# EAGLE design Mega_Shield_enjaksa (EAGLE 9.5.1)
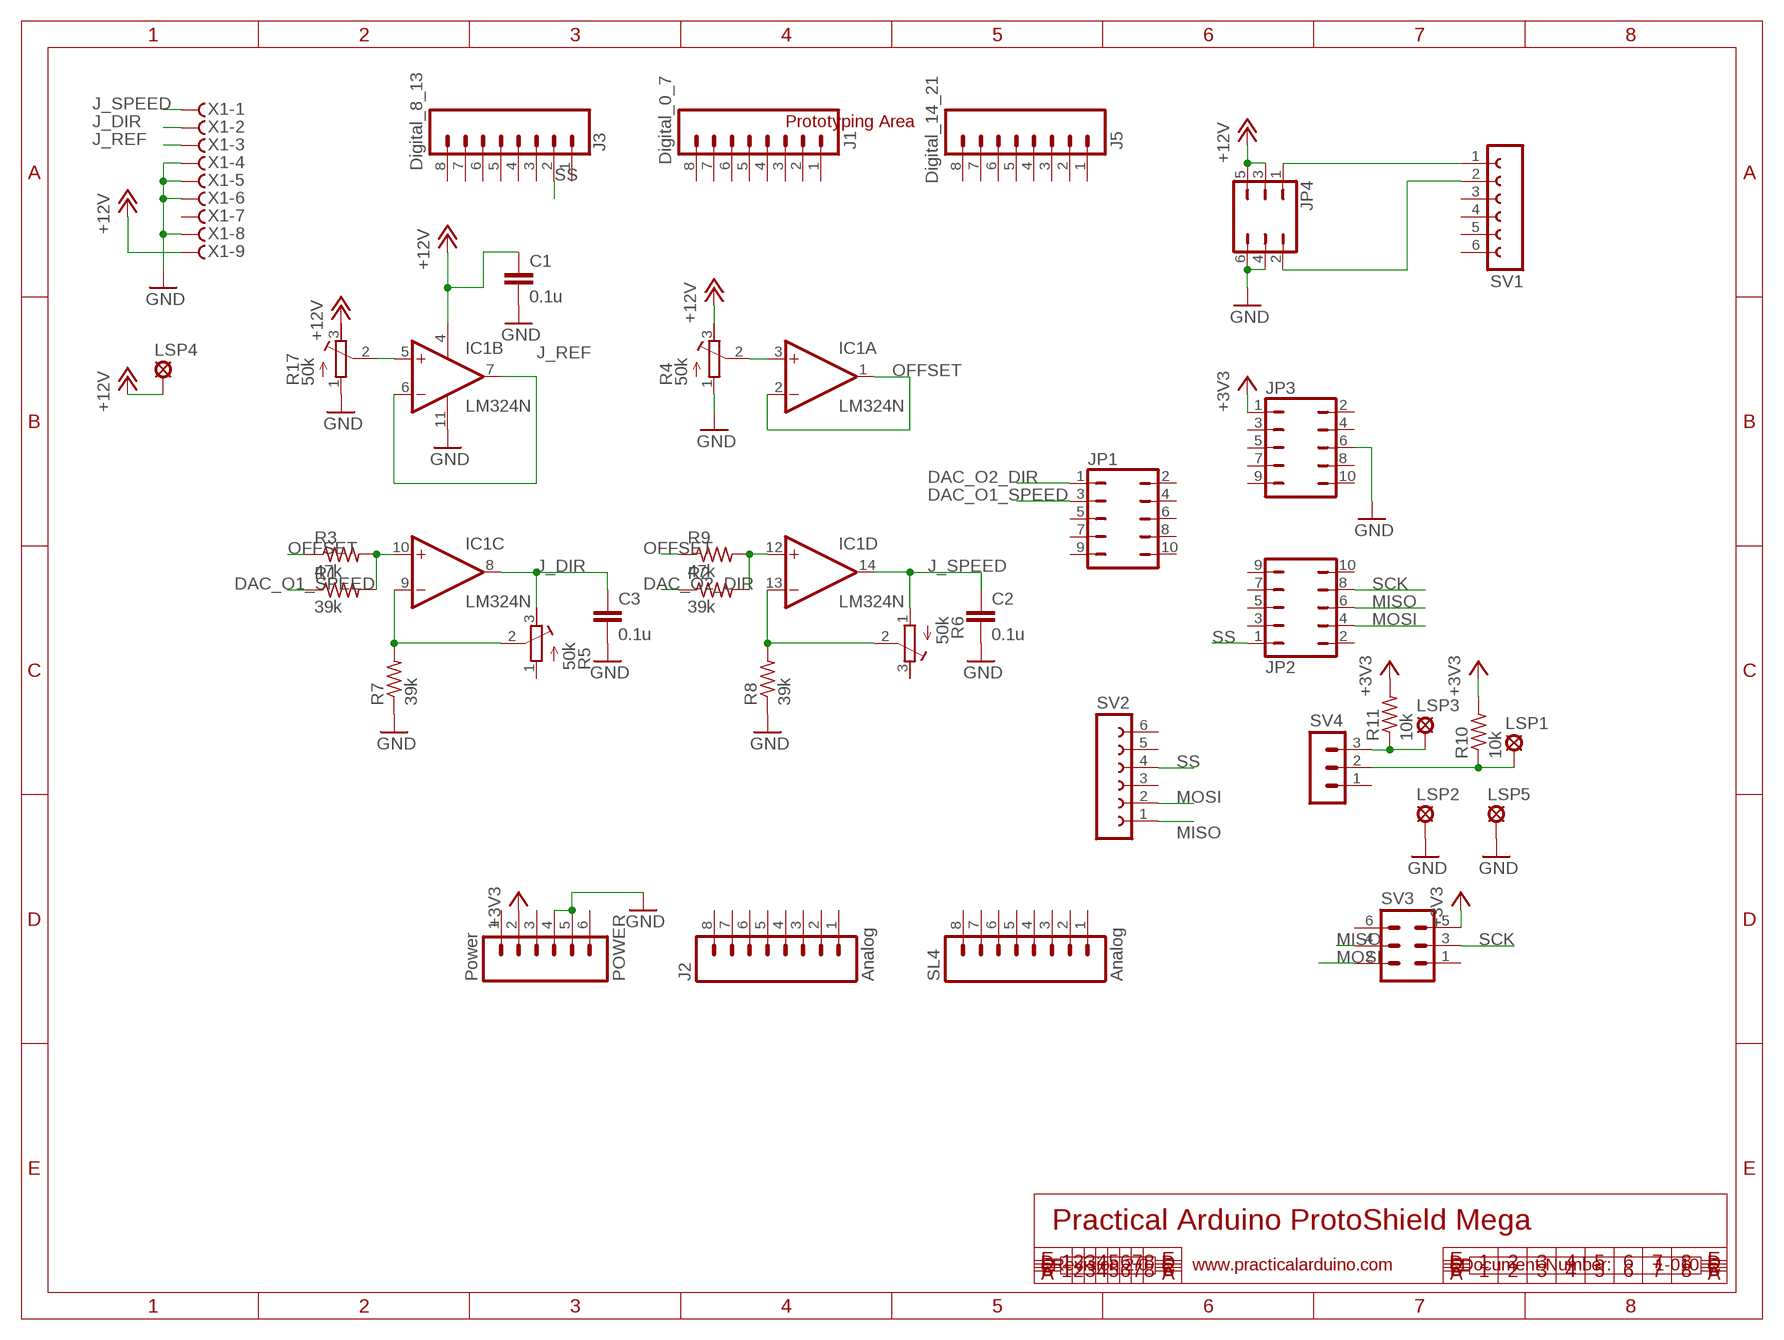
[diagram p0: schematic, sheet 1]

## Parts
C1  0.1u  C-EU025-024X044  [C025-024X044]
C2  0.1u  C-EU050-025X075  [C050-025X075]
C3  0.1u  C-EU025-024X044  [C025-024X044]
IC1  LM324N  [DIL14]
J1  Digital_0_7  M08  [1X08]
J2  Analog  M08  [1X08]
J3  Digital_8_13  M08  [1X08]
J5  Digital_14_21  M08  [1X08]
JP1  JP5Q  [JP5Q]
JP2  JP5Q  [JP5Q]
JP3  JP5Q  [JP5Q]
JP4  JP3Q  [JP3Q]
LSP1  SE13  [SE13]
LSP2  SE13  [SE13]
LSP3  SE13  [SE13]
LSP4  SE13  [SE13]
LSP5  SE13  [SE13]
POWER  Power  M06SIP  [1X06]
R1  39k  R-US_0204/7  [0204/7]
R2  39k  R-US_0204/7  [0204/7]
R3  47k  R-US_0204/7  [0204/7]
R4  50k  R-TRIMM64W  [RTRIM64W]
R5  50k  R-TRIMM64W  [RTRIM64W]
R6  50k  R-TRIMM64W  [RTRIM64W]
R7  39k  R-US_0204/7  [0204/7]
R8  39k  R-US_0204/2V  [0204V]
R9  47k  R-US_0204/7  [0204/7]
R10  10k  R-US_0204/2V  [0204V]
R11  10k  R-US_0204/2V  [0204V]
R17  50k  R-TRIMM64W  [RTRIM64W]
SL4  Analog  M08  [1X08]
SV1  FE06-1  [FE06]
SV2  FE06-1  [FE06]
SV3  MA03-2  [MA03-2]
SV4  MA03-1  [MA03-1]
X1  F09HS  [F09H]

## Nets
+3V3: JP3.1 POWER.2 R10.2 R11.2 SV3.5
+12V: C1.1 IC1.4(P:V+) JP4.3 JP4.5 LSP4.MP R4.3(E) R17.3(E) X1.9
DAC_O1_SPEED: JP1.3 R1.1
DAC_O2_DIR: JP1.1 R2.1
GND: C1.2 C2.2 C3.2 IC1.11(P:V-) JP3.6 JP4.4 JP4.6 LSP2.MP LSP5.MP POWER.4 POWER.5 R4.1(A) R7.1 R8.1 R17.1(A) X1.4 X1.5 X1.6 X1.8
J_DIR: C3.1 IC1.8(C:OUT) R5.3(E) X1.2
J_REF: IC1.6(B:-IN) IC1.7(B:OUT) X1.3
J_SPEED: C2.1 IC1.14(D:OUT) R6.1(A) X1.1
MISO: JP2.6 SV2.1 SV3.4
MOSI: JP2.4 SV2.2 SV3.2
N$1: JP4.2 SV1.2
N$2: IC1.5(B:+IN) R17.2(S)
N$3: IC1.3(A:+IN) R4.2(S)
N$4: JP4.1 SV1.1
N$5: LSP3.MP R11.1 SV4.3
N$6: LSP1.MP R10.1 SV4.2
N$363: IC1.13(D:-IN) R6.2(S) R8.2
N$365: IC1.12(D:+IN) R2.2 R9.2
N$366: IC1.9(C:-IN) R5.2(S) R7.2
N$368: IC1.10(C:+IN) R1.2 R3.2
OFFSET: IC1.1(A:OUT) IC1.2(A:-IN) R3.1 R9.1
SCK: JP2.8 SV3.3
SS: J3.2 JP2.1 SV2.4
Unconnected: J1.1 J1.2 J1.3 J1.4 J1.5 J1.6 J1.7 J1.8 J2.1 J2.2 J2.3 J2.4 J2.5 J2.6 J2.7 J2.8 J3.1 J3.3 J3.4 J3.5 J3.6 J3.7 J3.8 J5.1 J5.2 J5.3 J5.4 J5.5 J5.6 J5.7 J5.8 JP1.2 JP1.4 JP1.5 JP1.6 JP1.7 JP1.8 JP1.9 JP1.10 JP2.2 JP2.3 JP2.5 JP2.7 JP2.9 JP2.10 JP3.2 JP3.3 JP3.4 JP3.5 JP3.7 JP3.8 JP3.9 JP3.10 POWER.1 POWER.3 POWER.6 R5.1(A) R6.3(E) SL4.1 SL4.2 SL4.3 SL4.4 SL4.5 SL4.6 SL4.7 SL4.8 SV1.3 SV1.4 SV1.5 SV1.6 SV2.3 SV2.5 SV2.6 SV3.1 SV3.6 SV4.1 X1.7

## Notes on the sheet
- Prototyping Area
- Practical Arduino ProtoShield Mega
- Revision 2.0 | www.practicalarduino.com | Document Number: | 1-010

## Library data of the parts
C1-C3 = rcl:C-EU: CAPACITOR, European symbol; SPICEPREFIX: C
IC1 = linear:LM324: OP AMP
J1-J3 J5 SL4 = SparkFun:M08: Header 8 Standard 8-pin 0.1" header. Use with straight break away headers (SKU : PRT-00116), right angle break away headers (PRT-00553), swiss pins (PRT-00743), machine pins (PRT-00117), and female headers (PRT-00115).
JP1-JP3 = jumper:JP5Q: JUMPER
JP4 = jumper:JP3Q: JUMPER
LSP1-LSP5 = solpad:SE13: SOLDER PAD E1542, drill 1,3mm, distributor Buerklin, 07F815
POWER = SparkFun:M06: Header 6 Standard 6-pin 0.1" header. Use with straight break away headers (SKU : PRT-00116), right angle break away headers (PRT-00553), swiss pins (PRT-00743), machine pins (PRT-00117), and female headers (PRT-00115). Molex polarized connector foot print use with SKU : PRT-08094 with associated crimp pins and housings. NOTES ON THE VARIANTS LOCK and LOCK_LONGPADS... This footprint was designed to help hold the alignment of a through-hole component (i.e. 6-pin header) while soldering it into place. You may notice that each hole has been shifted either up or down by 0.005 of an inch from it's more standard position (which is a perfectly straight line). This slight alteration caused the pins (the squares in the middle) to touch the edges of the holes. Because they are alternating, it causes a "brace" to hold the component in place. 0.005 has proven to be the perfect amount of "off-center" position when using our standard breakaway headers. Although looks a little odd when you look at the bare footprint, once you have a header in there, the alteration is very hard to notice. Also, if you push a header all the way into place, it is covered up entirely on the bottom side. This idea of altering the position of holes to aid alignment will be further integrated into the Sparkfun Library for other footprints. It can help hold any component with 3 or more connection pins.
R1-R3 R7-R11 = rcl:R-US_: RESISTOR, American symbol; SPICEPREFIX: R
R4-R6 R17 = rcl:R-TRIMM: Trimm resistor; SPICEMODEL: X; SPICEPREFIXL: POT
SV1 SV2 = con-lsta:FE06-1: FEMALE HEADER; OC_FARNELL: unknown; OC_NEWARK: unknown
SV3 = con-lstb:MA03-2: PIN HEADER; OC_FARNELL: unknown; OC_NEWARK: unknown
SV4 = con-lstb:MA03-1: PIN HEADER; OC_FARNELL: unknown; OC_NEWARK: unknown
X1 = con-subd:F09?S: SUB-D; OC_FARNELL: unknown; OC_NEWARK: unknown

## Board
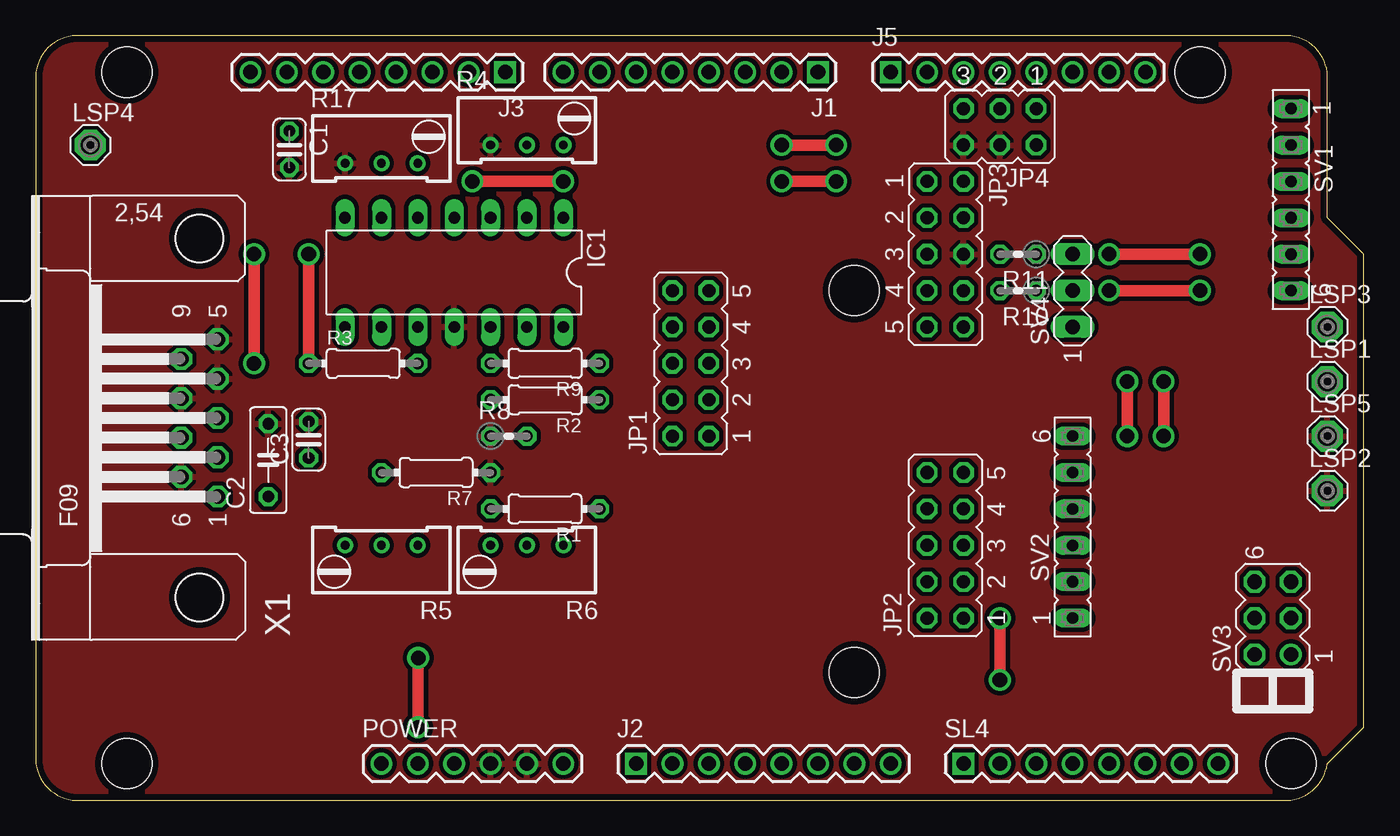
[diagram p1: board, top side]
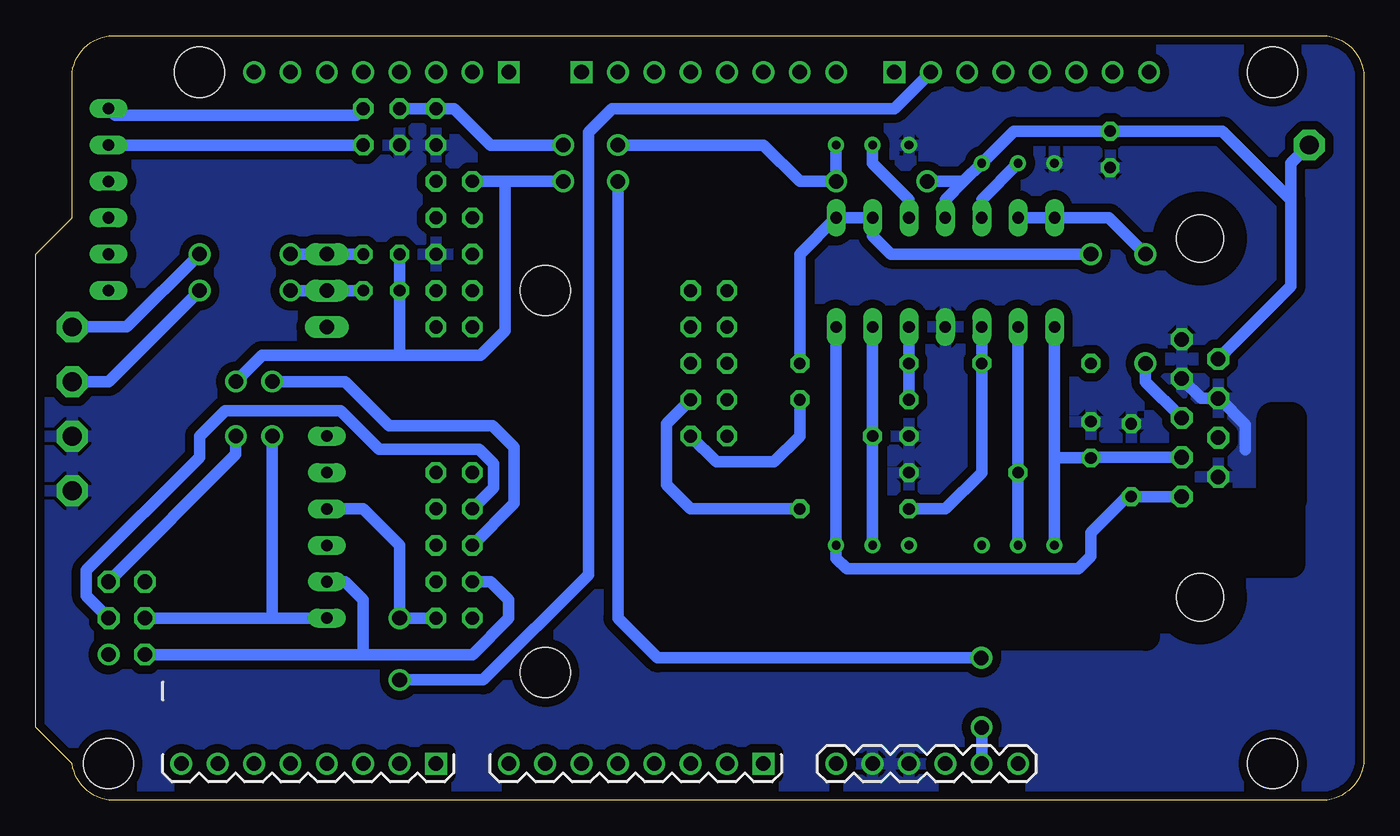
[diagram p2: board, bottom side, seen from below]

Size 92.71 x 53.34 mm. Coordinates in mm from the lower left corner, seen from the top.
Outline: 0,2.54 arc74 2.54,0 87.63,0 arc74 90.17,2.54 92.71,5.08 92.71,38.1 90.17,40.64 90.17,50.8 arc74 87.63,53.34 2.54,53.34 arc74 0,50.8 0,2.54
Copper layers (1*16): Top 0.035mm / dielectric 1.5mm / Bottom 0.035mm
Design rules "default *": minimum track width 10mil, minimum drill 0.3mm, track to track 12mil, track to pad 12mil, pad to pad 12mil, via to via 12mil, smd to smd 8mil, copper to edge 18mil, drill to drill 8mil, minimum pad ring 10mil, minimum via ring 8mil, stop-mask expansion 4mil, vias tented up to drill 0mil, thermal gap 10mil
Holes 3.5 mm at 6.35,50.8 81.28,50.8 6.35,2.54 87.63,2.54 57.15,8.89 57.15,35.56
bRestrict: area 15.2,11.4 to 49.5,14; area 5.1,14 to 17.8,20.8; area 5.1,21 to 6.4,26.7

### Footprints (pad centres in the part's own frame; a part is rotated, then mirrored left to right if it is on the bottom)
C025-024X044 = drill 0.813 octagon: 1 -1.27,0; 2 1.27,0
C050-025X075 = drill 0.813 octagon: 1 -2.54,0; 2 2.54,0
DIL14 = drill 0.813 long: 1 -7.62,-3.81; 2 -5.08,-3.81; 3 -2.54,-3.81; 4 0,-3.81; 5 2.54,-3.81; 6 5.08,-3.81; 7 7.62,-3.81; 8 7.62,3.81; 9 5.08,3.81; 10 2.54,3.81; 11 0,3.81; 12 -2.54,3.81; 13 -5.08,3.81; 14 -7.62,3.81
1X08 = drill 1.016 square: 1 0,0 | drill 1.016: 2 2.54,0; 3 5.08,0; 4 7.62,0; 5 10.16,0; 6 12.7,0; 7 15.24,0; 8 17.78,0
JP5Q = drill 0.914 octagon: 1 -5.08,-1.27; 2 -5.08,1.27; 3 -2.54,-1.27; 4 -2.54,1.27; 5 0,-1.27; 6 0,1.27; 7 2.54,-1.27; 8 2.54,1.27; 9 5.08,-1.27; 10 5.08,1.27
JP3Q = drill 0.914 octagon: 1 -2.54,-1.27; 2 -2.54,1.27; 3 0,-1.27; 4 0,1.27; 5 2.54,-1.27; 6 2.54,1.27
SE13 = drill 1.321 pad 2.159 octagon: MP 0,0
1X06 = drill 1.016: 1 0,0; 2 2.54,0; 3 5.08,0; 4 7.62,0; 5 10.16,0; 6 12.7,0
0204/7 = drill 0.813 octagon: 1 -3.81,0; 2 3.81,0
RTRIM64W = drill 0.61: 1 1.27,-2.54; 2 1.27,0; 3 1.27,2.54
0204V = drill 0.813 octagon: 1 -1.27,0; 2 1.27,0
FE06 = drill 0.813 long: 1 -6.35,0; 2 -3.81,0; 3 -1.27,0; 4 1.27,0; 5 3.81,0; 6 6.35,0
MA03-2 = drill 1.016: 1 -2.54,-1.27 | drill 1.016 octagon: 2 -2.54,1.27; 3 0,-1.27; 4 0,1.27; 5 2.54,-1.27; 6 2.54,1.27
MA03-1 = drill 1.016 long: 1 -2.54,0; 2 0,0; 3 2.54,0
F09H = drill 1.016 octagon: 1 -5.486,-1.27; 2 -2.743,-1.27; 3 0,-1.27; 4 2.743,-1.27; 5 5.486,-1.27; 6 -4.115,1.27; 7 -1.372,1.27; 8 1.372,1.27; 9 4.115,1.27 | hole 3.302: -12.522,0; 12.522,0

### Placement (x,y rotation side)
C1  17.7,45.42 270 top
C2  16.23,23.72 90 top
C3  19.05,25.15 90 top
IC1  29.21,36.83 180 top
J1  54.61,50.8 180 top
J2  41.91,2.54 0 top
J3  32.77,50.8 180 top
J5  59.69,50.8 0 top
JP1  45.72,30.48 90 top
JP2  63.5,17.78 90 top
JP3  63.5,38.1 270 top
JP4  67.31,46.99 180 top
LSP1  90.17,29.21 0 top
LSP2  90.17,21.59 0 top
LSP3  90.17,33.02 0 top
LSP4  3.81,45.72 0 top
LSP5  90.17,25.4 0 top
POWER  24.13,2.54 0 top
R1  35.56,20.32 180 top
R2  35.56,27.94 180 top
R3  22.86,30.48 0 top
R4  34.29,46.99 270 top
R5  24.13,16.51 90 top
R6  34.29,16.51 90 top
R7  27.94,22.86 180 top
R8  33.02,25.4 0 top
R9  35.56,30.48 180 top
R10  68.58,35.56 180 top
R11  68.58,38.1 180 top
R17  24.13,45.72 270 top
SL4  64.77,2.54 0 top
SV1  87.63,41.91 270 top
SV2  72.39,19.05 90 top
SV3  86.36,12.7 90 top
SV4  72.39,35.56 90 top
X1  11.43,26.67 90 top

### Tracks (layer width: path | path; a pad name or v marks a point on that pad's centre or on a via)
+3V3  (via drill 1.02)
  Top 0.813: v78.74,25.4 v78.74,29.21 | v26.67,5.08 26.7,5.11 v26.7,9.93 | v52.07,43.18 v55.88,43.18
  Bottom 0.813: v78.74,29.21 76.91,31.04 67.31,31.04 | 67.31,31.04 61.67,31.04 59.94,32.77 59.94,43.18 | 67.31,31.04 R10.2 R11.2 | POWER.2 v26.67,5.08 | v26.7,9.93 49.3,9.93 52.07,12.7 v52.07,43.18 | v55.88,43.18 59.94,43.18 | 59.94,43.18 JP3.1 | SV3.5 78.74,24.13 v78.74,25.4
+12V  (via drill 1.02)
  Top 0.813: v55.88,45.72 v52.07,45.72 | v36.83,43.18 v30.48,43.18
  Bottom 0.813: X1.9 5.08,35.87 5.08,41.91 | 5.08,41.91 9.86,46.69 C1.1 24.43,46.69 R17.3 27.94,43.18 | JP4.3 JP4.5 63.5,48.26 60.96,45.72 v55.88,45.72 | IC1.4 29.21,41.91 27.94,43.18 | 27.94,43.18 v30.48,43.18 | v52.07,45.72 41.91,45.72 39.37,43.18 v36.83,43.18 R4.3 | 5.08,41.91 5.08,44.45 LSP4.MP
DAC_O1_SPEED
  Bottom 0.813: R1.1 46.99,20.32 48.67,22 48.67,26.26 JP1.3
DAC_O2_DIR
  Bottom 0.813: JP1.1 45.19,23.6 41.17,23.6 39.37,25.4 R2.1
GND
  Bottom 0.813: 8.26,24.43 8.26,26.21 10.08,28.04 11.35,28.04 12.7,29.39 | 12.7,32.08 12.72,32.11
  pour Top: 0,50.8 arc-74 2.54,53.34 87.63,53.34 arc-74 90.17,50.8 90.17,40.64 92.71,38.1 92.71,5.08 90.17,2.54 arc-74 87.63,0 2.54,0 arc-74 0,2.54
  pour Bottom (isolate 0.61): -2.54,54.61 -2.54,-3.81 88.9,-3.81 95.25,2.54 95.25,50.8 88.9,57.15 -2.54,57.15
J_DIR
  Bottom 0.813: IC1.8 21.59,23.88 | 21.59,23.88 R5.3 | 21.59,23.88 C3.1 19,23.93 X1.2
J_REF  (via drill 1.02)
  Top 0.813: v15.24,38.1 v15.24,30.48
  Bottom 0.813: IC1.6 IC1.7 17.78,40.64 v15.24,38.1 | X1.3 15.24,29.21 v15.24,30.48
J_SPEED
  Bottom 0.813: IC1.14 R6.1 36.83,16.89 36.09,16.15 19.91,16.15 19.05,17.02 19.05,18.67 16.54,21.18 C2.1 X1.1
MISO  (via drill 1.02)
  Top 0.813: v76.2,25.4 v76.2,29.21
  Bottom 0.813: 76.2,12.7 v76.2,25.4 | SV3.4 76.2,12.7 | v76.2,29.21 71.12,29.21 68.05,26.14 60.81,26.14 59.31,24.64 59.31,20.7 JP2.6 | SV2.1 76.2,12.7
MOSI
  Bottom 0.813: SV2.2 71.12,15.24 69.85,13.97 69.85,10.16 | 69.85,10.16 62.23,10.16 59.69,12.7 59.69,13.97 60.96,15.24 JP2.4 | SV3.2 69.85,10.16
N$1
  Bottom 0.813: JP4.2 SV1.2
N$2
  Bottom 0.813: IC1.5 26.67,41.91 R17.2
N$3
  Bottom 0.813: R4.2 34.29,44.45 31.75,41.91 IC1.3
N$4
  Bottom 0.813: JP4.1 70.31,47.8 87.17,47.8 SV1.1
N$5  (via drill 1.02)
  Top 0.813: v81.28,38.1 v74.93,38.1
  Bottom 0.813: LSP3.MP 86.36,33.02 v81.28,38.1 | v74.93,38.1 SV4.3 R11.1
N$6  (via drill 1.02)
  Top 0.813: v74.93,35.56 v81.28,35.56
  Bottom 0.813: R10.1 SV4.2 v74.93,35.56 | v81.28,35.56 87.63,29.21 LSP1.MP
N$363
  Bottom 0.813: IC1.13 R8.2 R6.2
N$365
  Bottom 0.813: R2.2 R9.2 IC1.12
N$366
  Bottom 0.813: R5.2 R7.2 IC1.9
N$368
  Bottom 0.813: IC1.10 R3.2 26.67,22.86 29.21,20.32 R1.2
OFFSET  (via drill 1.02)
  Top 0.813: v19.05,38.1 R3.1
  Bottom 0.813: v19.05,38.1 33.02,38.1 34.29,39.37 IC1.2 IC1.1 39.37,38.1 R9.1
SCK
  Bottom 0.813: JP2.8 60.76,21.79 60.76,23.47 61.77,24.49 68.73,24.49 71.42,27.18 79.5,27.18 81.28,25.4 81.28,23.93 89.18,16.03 89.18,14.25 SV3.3
SS  (via drill 1.02)
  Top 0.813: v67.31,8.38 v67.31,12.7
  Bottom 0.813: SV2.4 69.85,20.32 67.31,17.78 v67.31,12.7 JP2.1 | v67.31,8.38 61.47,8.38 54.13,15.72 54.13,46.61 52.48,48.26 32.77,48.26 J3.2